# Altium schematic sheet BUCK.SchDoc
size A
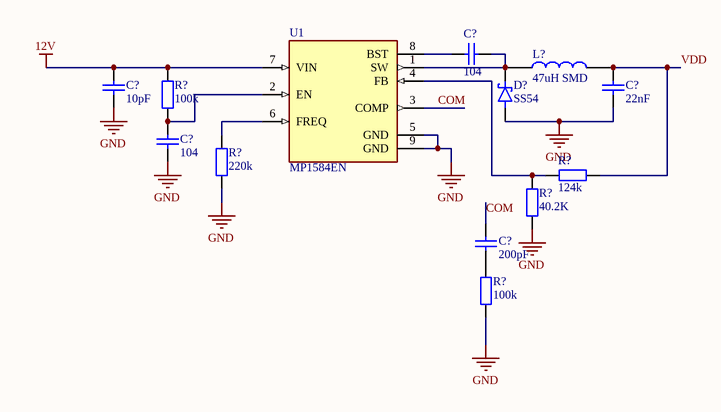
[diagram p0: BUCK.SchDoc]

## Parts
(Parts that share a designator on the sheet are numbered #1, #2 ... from top to bottom, then left to right.)
C?#1  104  [tu 0805]
C?#2  10pF  [tu 0805]
C?#3  22nF  [tu 0805]
C?#4  104  [tu 0805]
C?#5  200pF  [Tu 0805]
D?  SS54  [DIOM794X590X250]
L?  47uH SMD  [Cuon Cam 7x7x5]
R?#1  100k  [tro smd 0805]
R?#2  220k  [tro smd 0805]
R?#3  124k  [tro smd 0805]
R?#4  40.2K  [tro smd 0805]
R?#5  100k  [tro smd 0805]
U1  MP1584EN  [SOIC127P600X170-9N]

## Nets
12V: C?#2.1 R?#1.2 U1.7(VIN)
GND: C?#2.2 C?#3.2 C?#4.2 D?.A R?#2.1 R?#4.2 R?#5.1 U1.5(GND) U1.9(GND)
COM: C?#5.1 U1.3(COMP)
VDD: C?#3.1 L?.2 R?#3.1
NetC?#1_1: C?#1.1 D?.C L?.1 U1.1(SW)
NetC?#1_2: C?#1.2 U1.8(BST)
NetC?#4_1: C?#4.1 R?#1.1 U1.2(EN)
NetC?#5_2: C?#5.2 R?#5.2
NetR?#2_2: R?#2.2 U1.6(FREQ)
NetR?#3_2: R?#3.2 R?#4.1 U1.4(FB)

## Library data of the parts
C?#1 C?#4 = Tu 0805 104 50V 10%: Dán; Don_Vi: Con; So_Chan: 2; Ten_Linh_Kien: Tụ 0805 104-100nF 10% 50V; Ma_Hang: MH004551; Chung_Loai: Dán; Kieu_Chan: *
C?#2 = Tu 0805 10pF 50V 10%: Dán; Don_Vi: Con; So_Chan: 2; Ten_Linh_Kien: Tụ 0805 10P 10% 50V; Ma_Hang: MH004554; Chung_Loai: Dán; Kieu_Chan: *
C?#3 = Tu 0805 22nF 50V 20%: Dán; Don_Vi: Con; So_Chan: 2; Ten_Linh_Kien: Tụ 0805 22nF 50V 20%; Ma_Hang: MH007857; Chung_Loai: Dán; Kieu_Chan: *
C?#5 = Tu 0805 200pF 50V 10%: Dán; Ten_Linh_Kien: Tụ 0805 200p 10% 50V; Don_Vi: Con; So_Chan: 2; Ma_Hang: MH008100; Chung_Loai: Dán; Kieu_Chan: *
D? = B320-13-F: Diode Schottky 20V 3A 2Pin SMC | Diodes Inc B320-13-F; MF: Diodes Inc.; SnapEDA_Link: https://www.snapeda.com/parts/B320-13-F/Diodes+Inc./view-part/?ref=snap; Package: DO-214 Diodes Inc.; Value: *; MP: B320-13-F; Check_prices: https://www.snapeda.com/parts/B320-13-F/Diodes+Inc./view-part/?ref=eda
L? = CUON CAM 47uH SMD: Dán; Don_Vi: Con; Ma_Hang: MH004211; Ten_Linh_Kien: Cuộn Cảm 47uH 7x7x4MM CD74R; Ghi_Chu: *; Kieu_Chan: *; Chung_Loai: Dán
R?#1 R?#3-R?#5 = Tro 0805 1% 61.9k: Dán; Don_Vi: Con; So_Chan: 2; Ten_Linh_Kien: Trở 0805 1% 61.9k; Ma_Hang: MH005481; Chung_Loai: Dán; Kieu_Chan: *
R?#2 = Tro 0805 1% 220k: Dán; Don_Vi: Con; So_Chan: 2; Ten_Linh_Kien: Trở 0805 1% 220k; Ma_Hang: MH005484; Chung_Loai: Dán; Kieu_Chan: *
U1 = MP1584EN: Buck Switching Regulator IC Positive Adjustable 0.8V 1 Output 3A 8-SOIC (0.154, 3.90mm Width) Exposed Pad; MF: Monolithic Power; Value: *; SnapEDA_Link: https://www.snapeda.com/parts/MP1584EN/Monolithic+Power+Systems+Inc./view-part/?ref=snap; MP: MP1584EN; Purchase-URL: https://pricing.snapeda.com/search/part/MP1584EN/?ref=eda; Check_prices: https://www.snapeda.com/parts/MP1584EN/Monolithic+Power+Systems+Inc./view-part/?ref=eda; Availability: In Stock; Price: None; Package: SOIC-8 Monolithic Power